# EAGLE design 3hp (EAGLE 9.2.2)
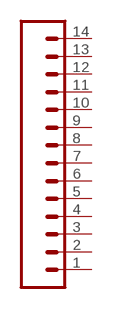
[diagram p0: schematic, sheet 1]

## Parts
J1  CONN_14SQUARE  [1X14]
Unconnected: J1.1 J1.2 J1.3 J1.4 J1.5 J1.6 J1.7 J1.8 J1.9 J1.10 J1.11 J1.12 J1.13 J1.14

## Library data of the parts
J1 = CFO:CONN_14: Multi connection point. Often used as Generic Header-pin footprint for 0.1 inch spaced/style header connections On any of the 0.1 inch spaced packages, you can populate with these: Break Away Headers - Straight <https://www.sparkfun.com/products/116> (PRT-00116) Break Away Male Headers - Right Angle <https://www.sparkfun.com/products/553> (PRT-00553) Female Headers <https://www.sparkfun.com/products/115> (PRT-00115) Break Away Headers - Machine Pin <https://www.sparkfun.com/products/117> (PRT-00117) Break Away Female Headers - Swiss Machine Pin <https://www.sparkfun.com/products/743> (PRT-00743) For SCREWTERMINALS and SPRING TERMINALS visit here: Screw Terimnals on SparkFun.com <https://www.sparkfun.com/search/results?term=Screw+Terminals> (5mm/3.5mm/2.54mm spacing) This device is also useful as a general connection point to wire up your design to another part of your project. Our various solder wires solder well into these plated through hole pads. Hook-Up Wire - Assortment (Stranded, 22 AWG) <https://www.sparkfun.com/products/11375> (PRT-11375) Hook-Up Wire - Assortment (Solid Core, 22 AWG) <https://www.sparkfun.com/products/11367> (PRT-11367) View the entire wire category on our website here <https://www.sparkfun.com/categories/141> Special notes: Molex polarized connector foot print use with SKU : PRT-08231 with associated crimp pins and housings. 1MM SMD Version SKU: PRT-10208 NOTES ON THE VARIANTS LOCK and LOCK_LONGPADS... This footprint was designed to help hold the alignment of a through-hole component (i.e. 6-pin header) while soldering it into place. You may notice that each hole has been shifted either up or down by 0.005 of an inch from it's more standard position (which is a perfectly straight line). This slight alteration caused the pins (the squares in the middle) to touch the edges of the holes. Because they are alternating, it causes a "brace" to hold the component in place. 0.005 has proven to be the perfect amount of "off-center" position when using our standard breakaway headers. Although looks a little odd when you look at the bare footprint, once you have a header in there, the alteration is very hard to notice. Also,if you push a header all the way into place, it is covered up entirely on the bottom side.

## Board
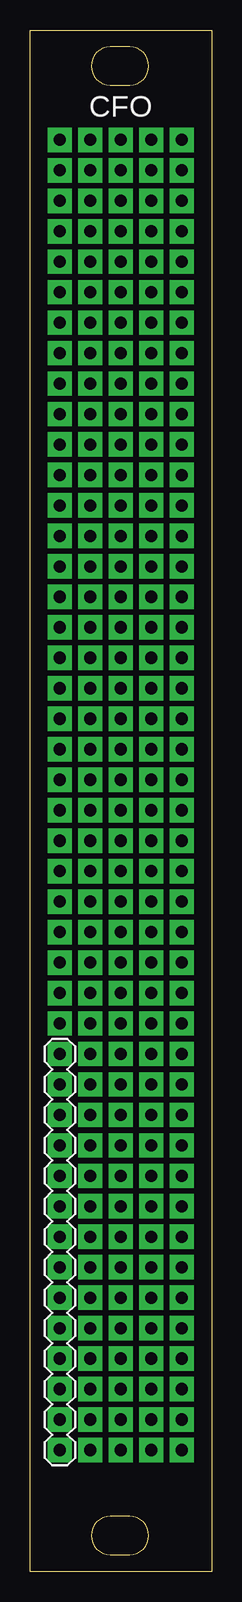
[diagram p1: board, top side]

Size 15.16 x 128.5 mm. Coordinates in mm from the lower left corner, seen from the top.
Outline: 15.16,0 0,0 0,128.5 15.16,128.5 15.16,0
Outline: 8.3,127.1 6.7,127.1 6.38,127.07 6.08,126.97 5.81,126.83 5.57,126.63 5.37,126.4 5.23,126.12 5.13,125.82 5.1,125.5 5.13,125.18 5.23,124.88 5.37,124.61 5.57,124.37 5.81,124.17 6.08,124.03 6.38,123.93 6.7,123.9 8.3,123.9 8.62,123.93 8.92,124.03 9.2,124.17 9.43,124.37 9.63,124.61 9.77,124.88 9.87,125.18 9.9,125.5 9.87,125.82 9.77,126.12 9.63,126.4 9.43,126.63 9.2,126.83 8.92,126.97 8.62,127.07 8.3,127.1
Outline: 8.3,4.6 6.7,4.6 6.38,4.57 6.08,4.47 5.81,4.33 5.57,4.13 5.37,3.9 5.23,3.62 5.13,3.32 5.1,3 5.13,2.68 5.23,2.38 5.37,2.11 5.57,1.87 5.81,1.67 6.08,1.53 6.38,1.43 6.7,1.4 8.3,1.4 8.62,1.43 8.92,1.53 9.2,1.67 9.43,1.87 9.63,2.11 9.77,2.38 9.87,2.68 9.9,3 9.87,3.32 9.77,3.62 9.63,3.9 9.43,4.13 9.2,4.33 8.92,4.47 8.62,4.57 8.3,4.6
Copper layers (1*16): Top 0.035mm / dielectric 1.5mm / Bottom 0.035mm
Design rules "default": minimum track width 6mil, minimum drill 0.35mm, track to track 6mil, track to pad 6mil, pad to pad 6mil, via to via 6mil, smd to smd 6mil, copper to edge 40mil, drill to drill 6mil, minimum pad ring 10mil, minimum via ring 8mil, stop-mask expansion 4mil, vias tented up to drill 0mil, thermal gap 10mil

### Footprints (pad centres in the part's own frame; a part is rotated, then mirrored left to right if it is on the bottom)
1X14 = drill 1.016 pad 2.032 square: 1 0,0; 2 2.54,0; 3 5.08,0; 4 7.62,0; 5 10.16,0; 6 12.7,0; 7 15.24,0; 8 17.78,0; 9 20.32,0; 10 22.86,0; 11 25.4,0; 12 27.94,0; 13 30.48,0; 14 33.02,0

### Placement (x,y rotation side)
J1  2.48,10.12 90 top

### Tracks (layer width: path | path; a pad name or v marks a point on that pad's centre or on a via)
N$1  (via drill 1.02 pad 2.03)
  other vias: 2.48,119.34
N$2  (via drill 1.02 pad 2.03)
  other vias: 5.02,119.34
N$3  (via drill 1.02 pad 2.03)
  other vias: 7.56,119.34
N$4  (via drill 1.02 pad 2.03)
  other vias: 10.1,119.34
N$5  (via drill 1.02 pad 2.03)
  other vias: 12.64,119.34
N$6  (via drill 1.02 pad 2.03)
  other vias: 2.48,116.8
N$7  (via drill 1.02 pad 2.03)
  other vias: 5.02,116.8
N$8  (via drill 1.02 pad 2.03)
  other vias: 7.56,116.8
N$9  (via drill 1.02 pad 2.03)
  other vias: 10.1,116.8
N$10  (via drill 1.02 pad 2.03)
  other vias: 12.64,116.8
N$11  (via drill 1.02 pad 2.03)
  other vias: 12.64,114.26
N$12  (via drill 1.02 pad 2.03)
  other vias: 10.1,114.26
N$13  (via drill 1.02 pad 2.03)
  other vias: 7.56,114.26
N$14  (via drill 1.02 pad 2.03)
  other vias: 5.02,114.26
N$15  (via drill 1.02 pad 2.03)
  other vias: 2.48,114.26
N$16  (via drill 1.02 pad 2.03)
  other vias: 2.48,111.72
N$17  (via drill 1.02 pad 2.03)
  other vias: 5.02,111.72
N$18  (via drill 1.02 pad 2.03)
  other vias: 7.56,111.72
N$19  (via drill 1.02 pad 2.03)
  other vias: 10.1,111.72
N$20  (via drill 1.02 pad 2.03)
  other vias: 12.64,111.72
N$21  (via drill 1.02 pad 2.03)
  other vias: 2.48,109.18
N$22  (via drill 1.02 pad 2.03)
  other vias: 5.02,109.18
N$23  (via drill 1.02 pad 2.03)
  other vias: 7.56,109.18
N$24  (via drill 1.02 pad 2.03)
  other vias: 10.1,109.18
N$25  (via drill 1.02 pad 2.03)
  other vias: 12.64,109.18
N$26  (via drill 1.02 pad 2.03)
  other vias: 12.64,106.64
N$27  (via drill 1.02 pad 2.03)
  other vias: 10.1,106.64
N$28  (via drill 1.02 pad 2.03)
  other vias: 7.56,106.64
N$29  (via drill 1.02 pad 2.03)
  other vias: 5.02,106.64
N$30  (via drill 1.02 pad 2.03)
  other vias: 2.48,106.64
N$31  (via drill 1.02 pad 2.03)
  other vias: 2.48,104.1
N$32  (via drill 1.02 pad 2.03)
  other vias: 5.02,104.1
N$33  (via drill 1.02 pad 2.03)
  other vias: 7.56,104.1
N$34  (via drill 1.02 pad 2.03)
  other vias: 10.1,104.1
N$35  (via drill 1.02 pad 2.03)
  other vias: 12.64,104.1
N$36  (via drill 1.02 pad 2.03)
  other vias: 12.64,101.56
N$37  (via drill 1.02 pad 2.03)
  other vias: 10.1,101.56
N$38  (via drill 1.02 pad 2.03)
  other vias: 7.56,101.56
N$39  (via drill 1.02 pad 2.03)
  other vias: 5.02,101.56
N$40  (via drill 1.02 pad 2.03)
  other vias: 2.48,101.56
N$41  (via drill 1.02 pad 2.03)
  other vias: 2.48,99.02
N$42  (via drill 1.02 pad 2.03)
  other vias: 5.02,99.02
N$43  (via drill 1.02 pad 2.03)
  other vias: 7.56,99.02
N$44  (via drill 1.02 pad 2.03)
  other vias: 10.1,99.02
N$45  (via drill 1.02 pad 2.03)
  other vias: 12.64,99.02
N$46  (via drill 1.02 pad 2.03)
  other vias: 12.64,96.48
N$47  (via drill 1.02 pad 2.03)
  other vias: 10.1,96.48
N$48  (via drill 1.02 pad 2.03)
  other vias: 12.64,93.94
N$49  (via drill 1.02 pad 2.03)
  other vias: 10.1,93.94
N$50  (via drill 1.02 pad 2.03)
  other vias: 7.56,93.94
N$51  (via drill 1.02 pad 2.03)
  other vias: 5.02,93.94
N$52  (via drill 1.02 pad 2.03)
  other vias: 2.48,93.94
N$53  (via drill 1.02 pad 2.03)
  other vias: 2.48,91.4
N$54  (via drill 1.02 pad 2.03)
  other vias: 5.02,91.4
N$55  (via drill 1.02 pad 2.03)
  other vias: 7.56,91.4
N$56  (via drill 1.02 pad 2.03)
  other vias: 10.1,91.4
N$57  (via drill 1.02 pad 2.03)
  other vias: 12.64,91.4
N$58  (via drill 1.02 pad 2.03)
  other vias: 12.64,88.86
N$59  (via drill 1.02 pad 2.03)
  other vias: 10.1,88.86
N$60  (via drill 1.02 pad 2.03)
  other vias: 7.56,88.86
N$61  (via drill 1.02 pad 2.03)
  other vias: 5.02,88.86
N$62  (via drill 1.02 pad 2.03)
  other vias: 2.48,88.86
N$63  (via drill 1.02 pad 2.03)
  other vias: 2.48,86.32
N$64  (via drill 1.02 pad 2.03)
  other vias: 5.02,86.32
N$65  (via drill 1.02 pad 2.03)
  other vias: 7.56,86.32
N$66  (via drill 1.02 pad 2.03)
  other vias: 10.1,86.32
N$67  (via drill 1.02 pad 2.03)
  other vias: 12.64,86.32
N$68  (via drill 1.02 pad 2.03)
  other vias: 7.56,96.48
N$69  (via drill 1.02 pad 2.03)
  other vias: 5.02,96.48
N$70  (via drill 1.02 pad 2.03)
  other vias: 2.48,96.48
N$71  (via drill 1.02 pad 2.03)
  other vias: 2.48,83.78
N$72  (via drill 1.02 pad 2.03)
  other vias: 5.02,83.78
N$73  (via drill 1.02 pad 2.03)
  other vias: 7.56,83.78
N$74  (via drill 1.02 pad 2.03)
  other vias: 10.1,83.78
N$75  (via drill 1.02 pad 2.03)
  other vias: 12.64,83.78
N$76  (via drill 1.02 pad 2.03)
  other vias: 2.48,81.24
N$77  (via drill 1.02 pad 2.03)
  other vias: 5.02,81.24
N$78  (via drill 1.02 pad 2.03)
  other vias: 7.56,81.24
N$79  (via drill 1.02 pad 2.03)
  other vias: 10.1,81.24
N$80  (via drill 1.02 pad 2.03)
  other vias: 12.64,81.24
N$81  (via drill 1.02 pad 2.03)
  other vias: 12.64,78.7
N$82  (via drill 1.02 pad 2.03)
  other vias: 10.1,78.7
N$83  (via drill 1.02 pad 2.03)
  other vias: 7.56,78.7
N$84  (via drill 1.02 pad 2.03)
  other vias: 5.02,78.7
N$85  (via drill 1.02 pad 2.03)
  other vias: 2.48,78.7
N$86  (via drill 1.02 pad 2.03)
  other vias: 2.48,76.16
N$87  (via drill 1.02 pad 2.03)
  other vias: 5.02,76.16
N$88  (via drill 1.02 pad 2.03)
  other vias: 7.56,76.16
N$89  (via drill 1.02 pad 2.03)
  other vias: 10.1,76.16
N$90  (via drill 1.02 pad 2.03)
  other vias: 12.64,76.16
N$91  (via drill 1.02 pad 2.03)
  other vias: 2.48,73.62
N$92  (via drill 1.02 pad 2.03)
  other vias: 5.02,73.62
N$93  (via drill 1.02 pad 2.03)
  other vias: 7.56,73.62
N$94  (via drill 1.02 pad 2.03)
  other vias: 10.1,73.62
N$95  (via drill 1.02 pad 2.03)
  other vias: 12.64,73.62
N$96  (via drill 1.02 pad 2.03)
  other vias: 12.64,71.08
N$97  (via drill 1.02 pad 2.03)
  other vias: 10.1,71.08
N$98  (via drill 1.02 pad 2.03)
  other vias: 7.56,71.08
N$99  (via drill 1.02 pad 2.03)
  other vias: 5.02,71.08
N$100  (via drill 1.02 pad 2.03)
  other vias: 2.48,71.08
N$101  (via drill 1.02 pad 2.03)
  other vias: 2.48,68.54
N$102  (via drill 1.02 pad 2.03)
  other vias: 5.02,68.54
N$103  (via drill 1.02 pad 2.03)
  other vias: 7.56,68.54
N$104  (via drill 1.02 pad 2.03)
  other vias: 10.1,68.54
N$105  (via drill 1.02 pad 2.03)
  other vias: 12.64,68.54
N$106  (via drill 1.02 pad 2.03)
  other vias: 12.64,66
N$107  (via drill 1.02 pad 2.03)
  other vias: 10.1,66
N$108  (via drill 1.02 pad 2.03)
  other vias: 7.56,66
N$109  (via drill 1.02 pad 2.03)
  other vias: 5.02,66
N$110  (via drill 1.02 pad 2.03)
  other vias: 2.48,66
N$111  (via drill 1.02 pad 2.03)
  other vias: 2.48,63.46
N$112  (via drill 1.02 pad 2.03)
  other vias: 5.02,63.46
N$113  (via drill 1.02 pad 2.03)
  other vias: 7.56,63.46
N$114  (via drill 1.02 pad 2.03)
  other vias: 10.1,63.46
N$115  (via drill 1.02 pad 2.03)
  other vias: 12.64,63.46
N$116  (via drill 1.02 pad 2.03)
  other vias: 12.64,60.92
N$117  (via drill 1.02 pad 2.03)
  other vias: 10.1,60.92
N$118  (via drill 1.02 pad 2.03)
  other vias: 12.64,58.38
N$119  (via drill 1.02 pad 2.03)
  other vias: 10.1,58.38
N$120  (via drill 1.02 pad 2.03)
  other vias: 7.56,58.38
N$121  (via drill 1.02 pad 2.03)
  other vias: 5.02,58.38
N$122  (via drill 1.02 pad 2.03)
  other vias: 2.48,58.38
N$123  (via drill 1.02 pad 2.03)
  other vias: 2.48,55.84
N$124  (via drill 1.02 pad 2.03)
  other vias: 5.02,55.84
N$125  (via drill 1.02 pad 2.03)
  other vias: 7.56,55.84
N$126  (via drill 1.02 pad 2.03)
  other vias: 10.1,55.84
N$127  (via drill 1.02 pad 2.03)
  other vias: 12.64,55.84
N$128  (via drill 1.02 pad 2.03)
  other vias: 12.64,53.3
N$129  (via drill 1.02 pad 2.03)
  other vias: 10.1,53.3
N$130  (via drill 1.02 pad 2.03)
  other vias: 7.56,53.3
N$131  (via drill 1.02 pad 2.03)
  other vias: 5.02,53.3
N$132  (via drill 1.02 pad 2.03)
  other vias: 2.48,53.3
N$133  (via drill 1.02 pad 2.03)
  other vias: 2.48,50.76
N$134  (via drill 1.02 pad 2.03)
  other vias: 5.02,50.76
N$135  (via drill 1.02 pad 2.03)
  other vias: 7.56,50.76
N$136  (via drill 1.02 pad 2.03)
  other vias: 10.1,50.76
N$137  (via drill 1.02 pad 2.03)
  other vias: 12.64,50.76
N$138  (via drill 1.02 pad 2.03)
  other vias: 7.56,60.92
N$139  (via drill 1.02 pad 2.03)
  other vias: 5.02,60.92
N$140  (via drill 1.02 pad 2.03)
  other vias: 2.48,60.92
N$141  (via drill 1.02 pad 2.03)
  other vias: 5.02,48.22
N$142  (via drill 1.02 pad 2.03)
  other vias: 7.56,48.22
N$143  (via drill 1.02 pad 2.03)
  other vias: 10.1,48.22
N$144  (via drill 1.02 pad 2.03)
  other vias: 12.64,48.22
N$145  (via drill 1.02 pad 2.03)
  other vias: 12.64,45.68
N$146  (via drill 1.02 pad 2.03)
  other vias: 10.1,45.68
N$147  (via drill 1.02 pad 2.03)
  other vias: 7.56,45.68
N$148  (via drill 1.02 pad 2.03)
  other vias: 5.02,45.68
N$149  (via drill 1.02 pad 2.03)
  other vias: 5.02,43.14
N$150  (via drill 1.02 pad 2.03)
  other vias: 7.56,43.14
N$151  (via drill 1.02 pad 2.03)
  other vias: 10.1,43.14
N$152  (via drill 1.02 pad 2.03)
  other vias: 12.64,43.14
N$153  (via drill 1.02 pad 2.03)
  other vias: 5.02,40.6
N$154  (via drill 1.02 pad 2.03)
  other vias: 7.56,40.6
N$155  (via drill 1.02 pad 2.03)
  other vias: 10.1,40.6
N$156  (via drill 1.02 pad 2.03)
  other vias: 12.64,40.6
N$157  (via drill 1.02 pad 2.03)
  other vias: 5.02,38.06
N$158  (via drill 1.02 pad 2.03)
  other vias: 7.56,38.06
N$159  (via drill 1.02 pad 2.03)
  other vias: 10.1,38.06
N$160  (via drill 1.02 pad 2.03)
  other vias: 12.64,38.06
N$161  (via drill 1.02 pad 2.03)
  other vias: 12.64,35.52
N$162  (via drill 1.02 pad 2.03)
  other vias: 10.1,35.52
N$163  (via drill 1.02 pad 2.03)
  other vias: 7.56,35.52
N$164  (via drill 1.02 pad 2.03)
  other vias: 5.02,35.52
N$165  (via drill 1.02 pad 2.03)
  other vias: 5.02,32.98
N$166  (via drill 1.02 pad 2.03)
  other vias: 7.56,32.98
N$167  (via drill 1.02 pad 2.03)
  other vias: 10.1,32.98
N$168  (via drill 1.02 pad 2.03)
  other vias: 12.64,32.98
N$169  (via drill 1.02 pad 2.03)
  other vias: 5.02,30.44
N$170  (via drill 1.02 pad 2.03)
  other vias: 7.56,30.44
N$171  (via drill 1.02 pad 2.03)
  other vias: 10.1,30.44
N$172  (via drill 1.02 pad 2.03)
  other vias: 12.64,30.44
N$173  (via drill 1.02 pad 2.03)
  other vias: 12.64,27.9
N$174  (via drill 1.02 pad 2.03)
  other vias: 10.1,27.9
N$175  (via drill 1.02 pad 2.03)
  other vias: 7.56,27.9
N$176  (via drill 1.02 pad 2.03)
  other vias: 5.02,27.9
N$177  (via drill 1.02 pad 2.03)
  other vias: 5.02,25.36
N$178  (via drill 1.02 pad 2.03)
  other vias: 7.56,25.36
N$179  (via drill 1.02 pad 2.03)
  other vias: 10.1,25.36
N$180  (via drill 1.02 pad 2.03)
  other vias: 12.64,25.36
N$181  (via drill 1.02 pad 2.03)
  other vias: 12.64,22.82
N$182  (via drill 1.02 pad 2.03)
  other vias: 10.1,22.82
N$183  (via drill 1.02 pad 2.03)
  other vias: 7.56,22.82
N$184  (via drill 1.02 pad 2.03)
  other vias: 5.02,22.82
N$185  (via drill 1.02 pad 2.03)
  other vias: 5.02,20.28
N$186  (via drill 1.02 pad 2.03)
  other vias: 7.56,20.28
N$187  (via drill 1.02 pad 2.03)
  other vias: 10.1,20.28
N$188  (via drill 1.02 pad 2.03)
  other vias: 12.64,20.28
N$189  (via drill 1.02 pad 2.03)
  other vias: 12.64,17.74
N$190  (via drill 1.02 pad 2.03)
  other vias: 10.1,17.74
N$191  (via drill 1.02 pad 2.03)
  other vias: 12.64,15.2
N$192  (via drill 1.02 pad 2.03)
  other vias: 10.1,15.2
N$193  (via drill 1.02 pad 2.03)
  other vias: 7.56,15.2
N$194  (via drill 1.02 pad 2.03)
  other vias: 5.02,15.2
N$195  (via drill 1.02 pad 2.03)
  other vias: 5.02,12.66
N$196  (via drill 1.02 pad 2.03)
  other vias: 7.56,12.66
N$197  (via drill 1.02 pad 2.03)
  other vias: 10.1,12.66
N$198  (via drill 1.02 pad 2.03)
  other vias: 12.64,12.66
N$199  (via drill 1.02 pad 2.03)
  other vias: 12.64,10.12
N$200  (via drill 1.02 pad 2.03)
  other vias: 10.1,10.12
N$201  (via drill 1.02 pad 2.03)
  other vias: 7.56,10.12
N$202  (via drill 1.02 pad 2.03)
  other vias: 5.02,10.12
N$207  (via drill 1.02 pad 2.03)
  other vias: 7.56,17.74
N$208  (via drill 1.02 pad 2.03)
  other vias: 5.02,17.74
N$209  (via drill 1.02 pad 2.03)
  other vias: 2.48,48.22
N$210  (via drill 1.02 pad 2.03)
  other vias: 2.48,45.68

### Text on the board
tNames: CFO